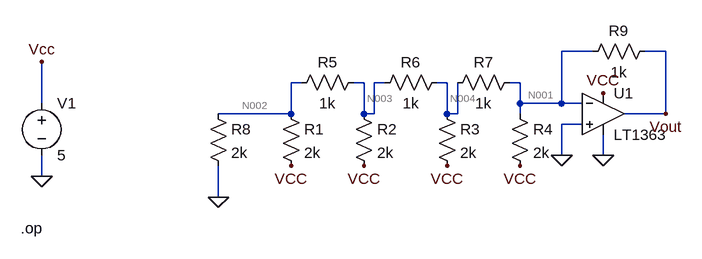
[diagram p0: schematic Draft1.asc]
Draft1.asc, the LTspice schematic file:
Version 4.1
SHEET 1 880 680
WIRE 608 48 560 48
WIRE 720 48 688 48
WIRE 160 96 144 96
WIRE 256 96 240 96
WIRE 288 96 272 96
WIRE 384 96 368 96
WIRE 496 96 480 96
WIRE -240 128 -240 64
WIRE 496 128 496 96
WIRE 560 128 560 48
WIRE 560 128 496 128
WIRE 592 128 560 128
WIRE 144 144 144 96
WIRE 144 144 32 144
WIRE 256 144 256 96
WIRE 272 144 272 96
WIRE 272 144 256 144
WIRE 384 144 384 96
WIRE 400 144 400 96
WIRE 400 144 384 144
WIRE 496 144 496 128
WIRE 720 144 720 48
WIRE 720 144 656 144
WIRE 592 160 560 160
WIRE 560 208 560 160
WIRE 624 208 624 176
WIRE -240 240 -240 208
WIRE 32 272 32 224
FLAG 32 272 0
FLAG 560 208 0
FLAG -240 240 0
FLAG -240 64 Vcc
FLAG 624 112 VCC
FLAG 624 208 0
FLAG 144 224 VCC
FLAG 256 224 VCC
FLAG 384 224 VCC
FLAG 496 224 VCC
FLAG 720 144 Vout
SYMBOL res 128 128 R0
SYMATTR InstName R1
SYMATTR Value 2k
SYMBOL res 240 128 R0
SYMATTR InstName R2
SYMATTR Value 2k
SYMBOL res 368 128 R0
SYMATTR InstName R3
SYMATTR Value 2k
SYMBOL res 480 128 R0
SYMATTR InstName R4
SYMATTR Value 2k
SYMBOL res 256 80 R90
WINDOW 0 0 56 VBottom 2
WINDOW 3 32 56 VTop 2
SYMATTR InstName R5
SYMATTR Value 1k
SYMBOL res 384 80 R90
WINDOW 0 0 56 VBottom 2
WINDOW 3 32 56 VTop 2
SYMATTR InstName R6
SYMATTR Value 1k
SYMBOL res 496 80 R90
WINDOW 0 0 56 VBottom 2
WINDOW 3 32 56 VTop 2
SYMATTR InstName R7
SYMATTR Value 1k
SYMBOL res 16 128 R0
SYMATTR InstName R8
SYMATTR Value 2k
SYMBOL OpAmps\\LT1363 624 80 R0
SYMATTR InstName U1
SYMBOL res 704 32 R90
WINDOW 0 0 56 VBottom 2
WINDOW 3 32 56 VTop 2
SYMATTR InstName R9
SYMATTR Value 1k
SYMBOL voltage -240 112 R0
WINDOW 123 0 0 Left 0
WINDOW 39 0 0 Left 0
SYMATTR InstName V1
SYMATTR Value 5
TEXT -272 320 Left 2 !.op

The netlist it stands for:
* Draft1.asc
R1 N002 Vcc 2k
R2 N003 Vcc 2k
R3 N004 Vcc 2k
R4 N001 Vcc 2k
R5 N003 N002 1k
R6 N004 N003 1k
R7 N001 N004 1k
R8 N002 0 2k
X§U1 0 N001 Vcc 0 Vout LT1363  ; pins In+ In- V+ V- OUT
R9 Vout N001 1k
V1 Vcc 0 5
.op
.lib LT1363.sub
.backanno
.end

* Results of the author's LTspice run, read from the files saved beside the schematic
* Operating Point:
*   V(vcc) = 5 V
*   V(n004) = 3.526 V
*   V(n001) = 2.676 V
*   V(n002) = 3.069 V
*   V(n003) = 3.638 V
*   V(vout) = 665.9 mV
*   I(R3) = -737.2 µA
*   I(R5) = 568.9 µA
*   I(R6) = -112.2 µA
*   I(R8) = 1.534 mA
*   I(V1) = -6.538 mA
*   I(R1) = -965.6 µA
*   I(R2) = -681.1 µA
*   I(R4) = -1.162 mA
*   I(R7) = -849.4 µA
*   I(R9) = -2.01 mA
*   Ix(u1:1) = -585.2 nA
*   Ix(u1:2) = 1.139 µA
*   Ix(u1:3) = 2.992 mA
*   Ix(u1:4) = -5.003 mA
*   Ix(u1:5) = 2.01 mA